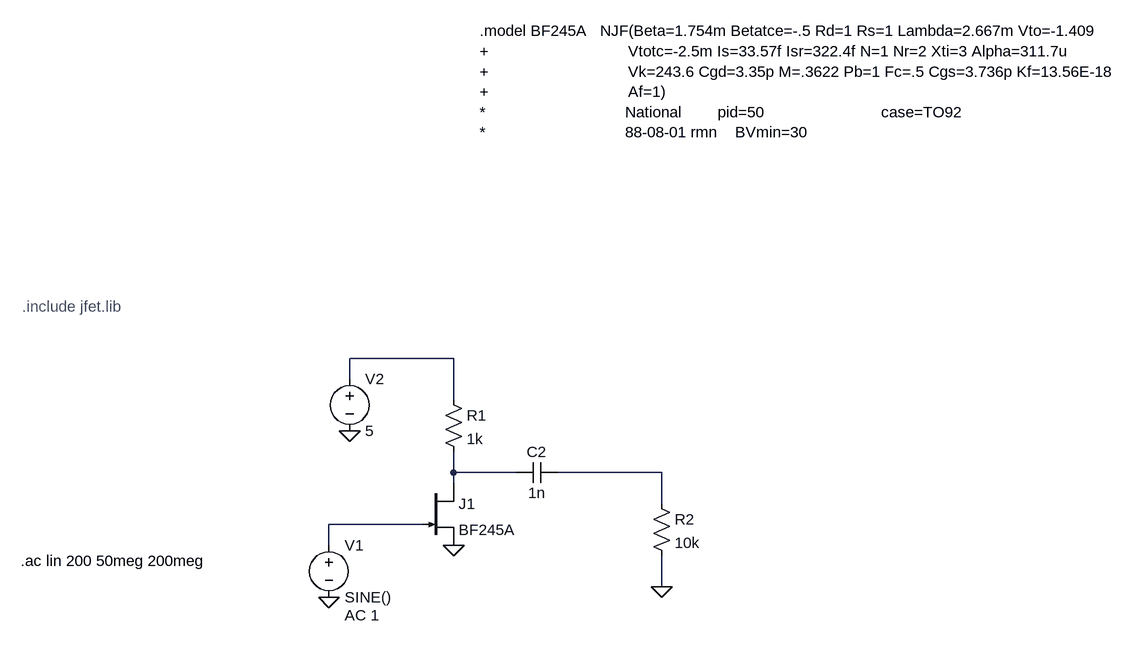
[diagram p0: schematic BF245_BAse.asc]
BF245_BAse.asc, the LTspice schematic file:
Version 4
SHEET 1 1796 680
WIRE 176 -64 16 -64
WIRE 16 -32 16 -64
WIRE 176 0 176 -64
WIRE 176 112 176 80
WIRE 272 112 176 112
WIRE 496 112 336 112
WIRE 176 128 176 112
WIRE 496 160 496 112
WIRE 128 192 -16 192
WIRE -16 224 -16 192
WIRE 496 288 496 240
FLAG 176 224 0
FLAG -16 304 0
FLAG 16 48 0
FLAG 496 288 0
SYMBOL voltage -16 208 R0
WINDOW 123 24 124 Left 2
WINDOW 39 0 0 Left 0
SYMATTR InstName V1
SYMATTR Value SINE()
SYMATTR Value2 AC 1
SYMBOL njf 128 128 R0
SYMATTR InstName J1
SYMATTR Value BF245A
SYMBOL voltage 16 -48 R0
WINDOW 123 0 0 Left 0
WINDOW 39 0 0 Left 0
SYMATTR InstName V2
SYMATTR Value 5
SYMBOL res 160 -16 R0
SYMATTR InstName R1
SYMATTR Value 1k
SYMBOL cap 336 96 R90
WINDOW 0 0 32 VBottom 2
WINDOW 3 32 32 VTop 2
SYMATTR InstName C2
SYMATTR Value 1n
SYMBOL res 480 144 R0
SYMATTR InstName R2
SYMATTR Value 10k
TEXT -488 -144 Left 2 ;.include jfet.lib
TEXT -490 248 Left 2 !.ac lin 200 50meg 200meg
TEXT 216 -568 Left 2 !.model BF245A   NJF(Beta=1.754m Betatce=-.5 Rd=1 Rs=1 Lambda=2.667m Vto=-1.409\n+                               Vtotc=-2.5m Is=33.57f Isr=322.4f N=1 Nr=2 Xti=3 Alpha=311.7u\n+                               Vk=243.6 Cgd=3.35p M=.3622 Pb=1 Fc=.5 Cgs=3.736p Kf=13.56E-18\n+                               Af=1)\n*                               National        pid=50                          case=TO92\n*                               88-08-01 rmn    BVmin=30

The netlist it stands for:
* BF245_BAse.asc
V1 N004 0 SINE() AC 1
J1 N002 N004 0 BF245A
V2 N001 0 5
R1 N001 N002 1k
C2 N003 N002 1n
R2 N003 0 10k
.model NJF NJF
.model PJF PJF
.lib standard.jft
* .include jfet.lib
.ac lin 200 50meg 200meg
.model BF245A   NJF(Beta=1.754m Betatce=-.5 Rd=1 Rs=1 Lambda=2.667m Vto=-1.409
+                               Vtotc=-2.5m Is=33.57f Isr=322.4f N=1 Nr=2 Xti=3 Alpha=311.7u
+                               Vk=243.6 Cgd=3.35p M=.3622 Pb=1 Fc=.5 Cgs=3.736p Kf=13.56E-18
+                               Af=1)
*                               National        pid=50                          case=TO92
*                               88-08-01 rmn    BVmin=30
.backanno
.end